# EAGLE design gLCD_i2c (EAGLE 4.16)
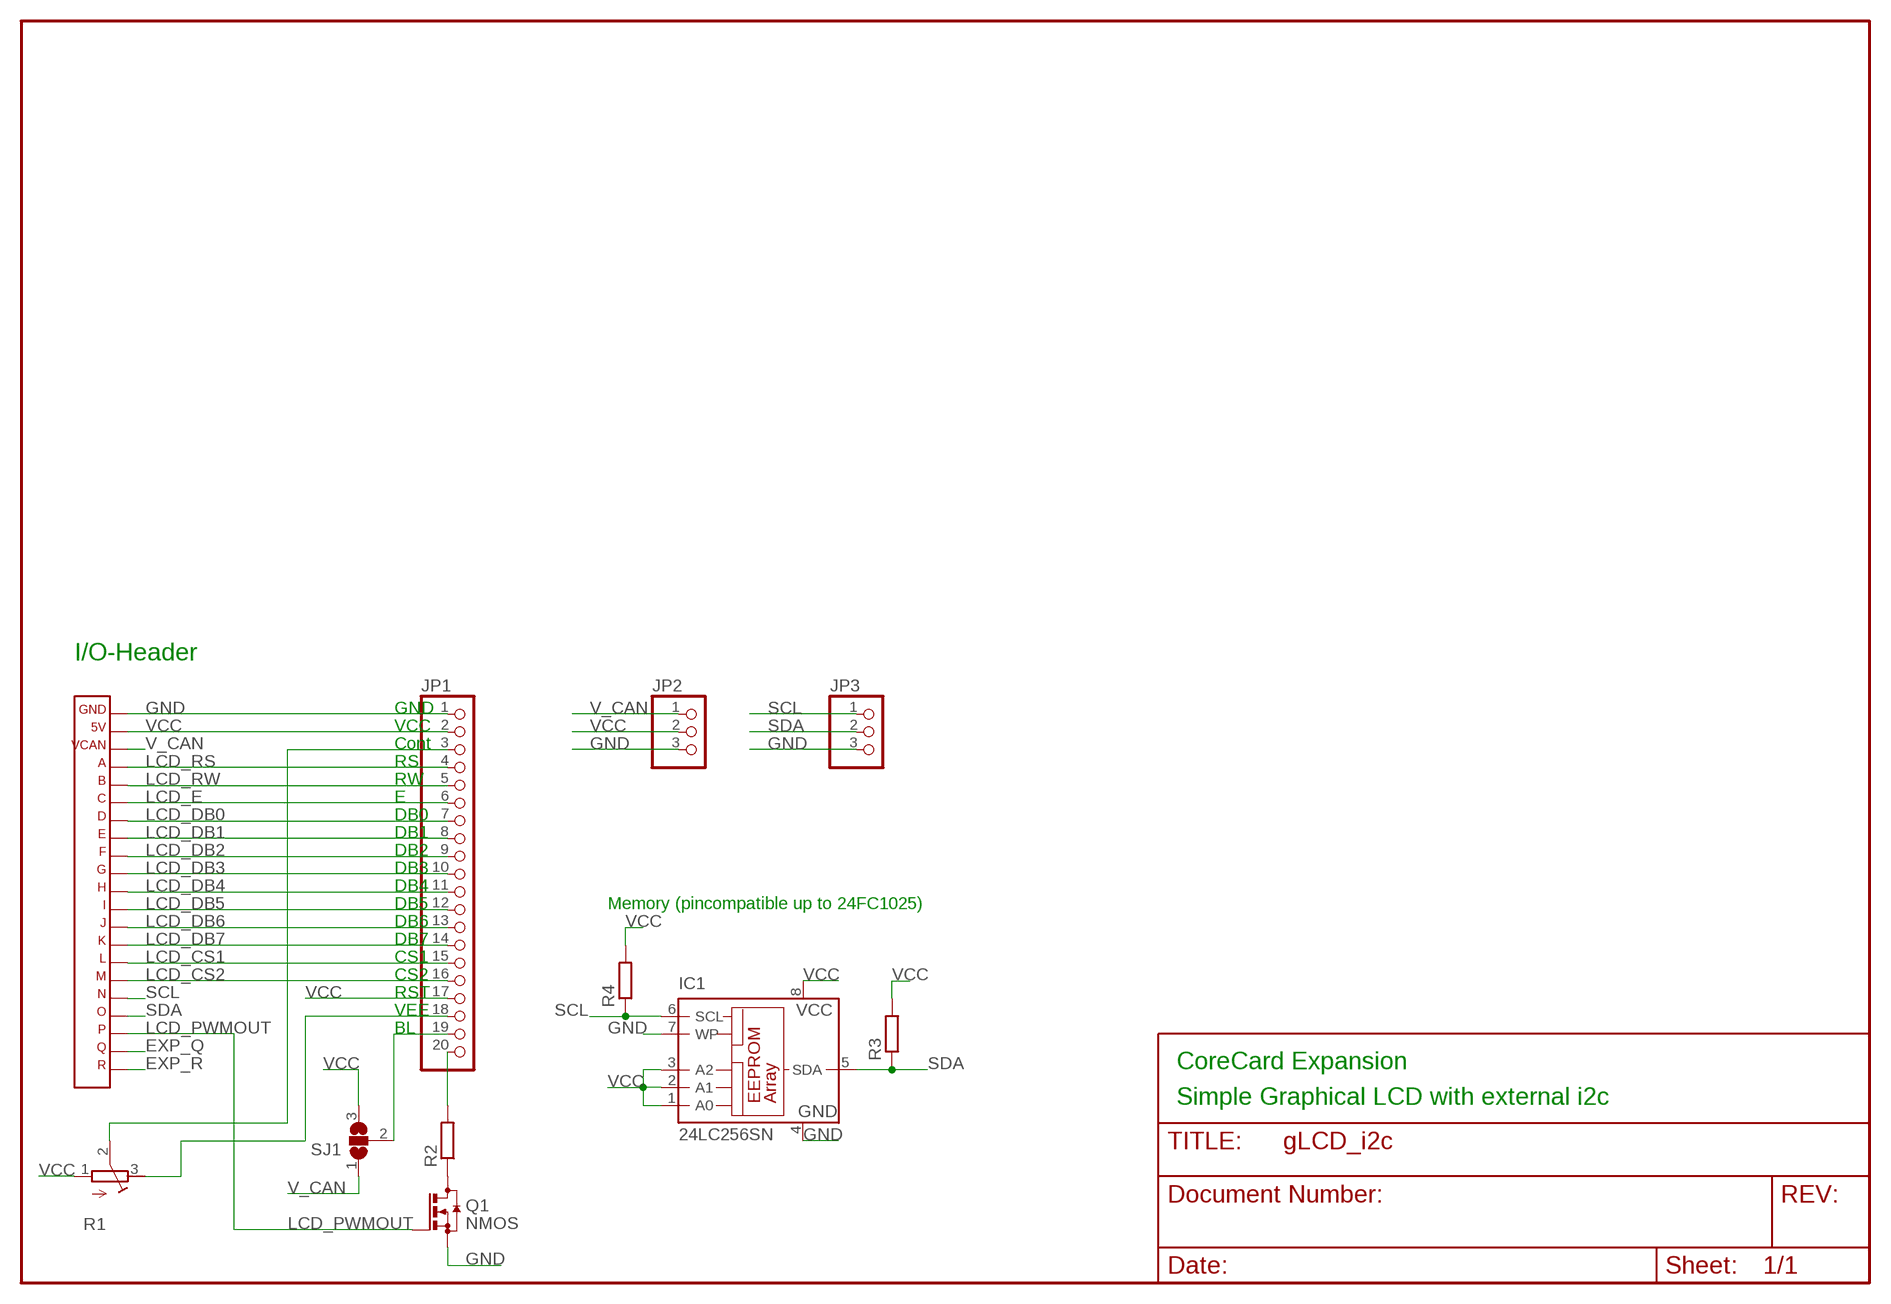
[diagram p0: schematic, sheet 1]

## Parts
IC1  24LC256SN  [SO-08]
JP1  PINHD-2X10  [2X10]
JP2  PINHD-1X3  [1X03]
JP3  PINHD-1X3  [1X03]
Q1  NMOS  [SOT23]
R1  R-TRIM  [TRIM_PVZ3]
R2  R-EU_0207/10  [0207/10]
R3  R-EUR0603  [R0603]
R4  R-EUR0603  [R0603]
SJ1  SJ_2_NOS  [SJ_2_NO_SMALL]
X3  CORE_IOHEADEXP  [CORE_IOHEAD_NOSILC]

## Nets
EXP_Q: X3.20
EXP_R: X3.21
GND: IC1.4(GND) IC1.7(WP) JP1.1 JP2.3 JP3.3 Q1.2(S) X3.1
LCD_CONTRAST: JP1.3 R1.2(PAD2)
LCD_CS1: JP1.15 X3.15
LCD_CS2: JP1.16 X3.16
LCD_DB0: JP1.7 X3.7
LCD_DB1: JP1.8 X3.8
LCD_DB2: JP1.9 X3.9
LCD_DB3: JP1.10 X3.10
LCD_DB4: JP1.11 X3.11
LCD_DB5: JP1.12 X3.12
LCD_DB6: JP1.13 X3.13
LCD_DB7: JP1.14 X3.14
LCD_E: JP1.6 X3.6
LCD_PWMOUT: Q1.1(G) X3.19
LCD_RS: JP1.4 X3.4
LCD_RW: JP1.5 X3.5
LCD_VEE: JP1.18 R1.3(PAD3)
N$1: Q1.3(D) R2.1
N$2: JP1.19 SJ1.2
N$4: JP1.20 R2.2
SCL: IC1.6(SCL) JP3.1 R4.1 X3.17
SDA: IC1.5(SDA) JP3.2 R3.1 X3.18
V_CAN: JP2.1 SJ1.1 X3.3
VCC: IC1.1(A0) IC1.2(A1) IC1.3(A2) IC1.8(VCC) JP1.2 JP1.17 JP2.2 R1.1(PAD1) R3.2 R4.2 SJ1.3 X3.2

## Notes on the sheet
- I/O-Header
- GND
- VCC
- Cont
- RS
- RW
- E
- DB0
- DB1
- DB2
- DB3
- DB4
- DB5 | Memory (pincompatible up to 24FC1025)
- DB6
- DB7
- CS1
- CS2
- RST
- VEE
- BL
- CoreCard Expansion
- Simple Graphical LCD with external i2c

## Library data of the parts
IC1 = microchip:24*: Serial EEPROM I2C
JP1 = pinhead-mm:PINHD-2X10
JP2 JP3 = pinhead:PINHD-1X3: PIN HEADER
Q1 = transistor:NMOS
R1 = rcl:R-TRIM
R2 = rcl:R-EU_: RESISTOR, European symbol
R3 R4 = rcl:R-EU
SJ1 = jumper:SJ_2_NO
X3 = expboard:CORE_IOHEAD: CoreCard IO-header for expansion cards

## Board
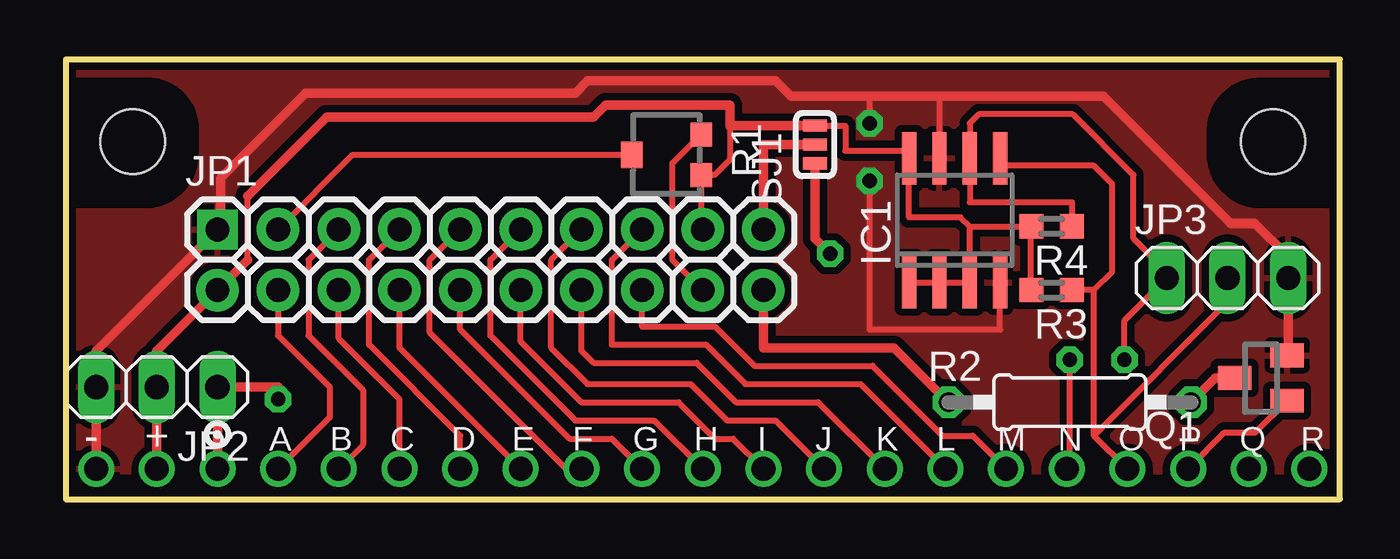
[diagram p1: board, top side]
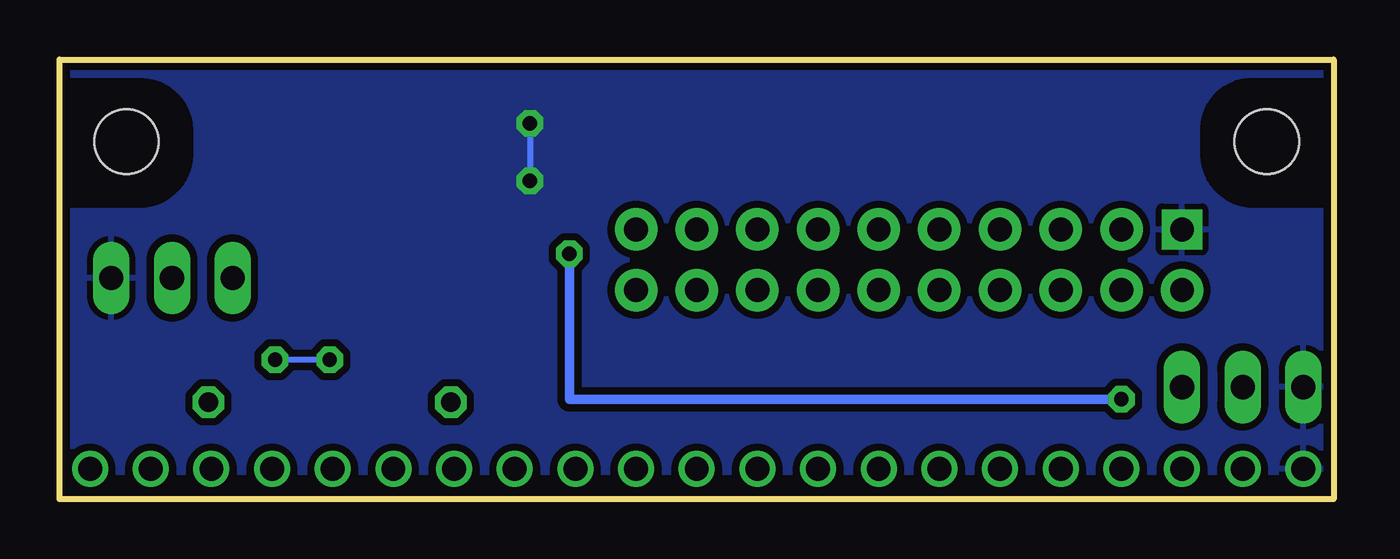
[diagram p2: board, bottom side, seen from below]

Size 53.34 x 18.41 mm. Coordinates in mm from the lower left corner, seen from the top.
Outline: 0,0 53.34,0 53.34,18.41 0,18.41 0,0
Copper layers (1*16): Top 0.035mm / dielectric 1.5mm / Bottom 0.035mm
Design rules "default": minimum track width 10mil, minimum drill 0.6mm, track to track 10mil, track to pad 10mil, pad to pad 10mil, via to via 10mil, smd to smd 8mil, copper to edge 10mil, drill to drill 8mil, minimum pad ring 10mil, minimum via ring 10mil, stop-mask expansion 4mil, vias tented up to drill 0mil, thermal gap 10mil
Holes 2.7 mm at 50.55,14.99 2.79,14.99

### Footprints (pad centres in the part's own frame; a part is rotated, then mirrored left to right if it is on the bottom)
SO-08 = smd 0.6 x 2.2: 1 -1.905,-2.6; 2 -0.635,-2.6; 3 0.635,-2.6; 4 1.905,-2.6; 5 1.905,2.6; 6 0.635,2.6; 7 -0.635,2.6; 8 -1.905,2.6
2X10 = drill 1 pad 1.676 square: 1 -10.16,1.27 | drill 1 pad 1.778 round: 2 -10.16,-1.27; 3 -7.62,1.27; 4 -7.62,-1.27; 5 -5.08,1.27; 6 -5.08,-1.27; 7 -2.54,1.27; 8 -2.54,-1.27; 9 0,1.27; 10 0,-1.27; 11 2.54,1.27; 12 2.54,-1.27; 13 5.08,1.27; 14 5.08,-1.27; 15 7.62,1.27; 16 7.62,-1.27; 17 10.16,1.27; 18 10.16,-1.27; 19 12.7,1.27; 20 12.7,-1.27
1X03 = drill 1.016 long: 1 -2.54,0; 2 0,0; 3 2.54,0
SOT23 = smd 1 x 1.4: 1 -0.95,-1.1; 2 0.95,-1.1; 3 0,1.1
TRIM_PVZ3 = smd 1 x 0.9: 1 0.5,0.45; 3 2.2,0.45 | smd 1.1 x 0.9: 2 1.35,3.35
0207/10 = drill 0.813 octagon: 1 -5.08,0; 2 5.08,0
R0603 = smd 0.991 x 1.016: 1 -0.85,0; 2 0.85,0
SJ_2_NO_SMALL = smd 0.508 x 1.016: 1 -0.787,0; 2 0,0; 3 0.787,0
CORE_IOHEAD_NOSILC = drill 1 round: 1 25.4,0; 2 22.86,0; 3 20.32,0; 4 17.78,0; 5 15.24,0; 6 12.7,0; 7 10.16,0; 8 7.62,0; 9 5.08,0; 10 2.54,0; 11 0,0; 12 -2.54,0; 13 -5.08,0; 14 -7.62,0; 15 -10.16,0; 16 -12.7,0; 17 -15.24,0; 18 -17.78,0; 19 -20.32,0; 20 -22.86,0; 21 -25.4,0

### Placement (x,y rotation side)
IC1  37.21,11.68 0 top
JP1  16.51,10.03 0 top
JP2  3.81,4.7 180 top
JP3  48.64,9.27 0 top
Q1  50.04,5.08 90 top
R1  27.05,13.08 90 top
R2  42.04,4.06 180 top
R3  41.27,8.76 180 top
R4  41.27,11.43 180 top
SJ1  31.37,14.86 90 top
X3  26.67,1.27 0 bottom

### Tracks (layer width: path | path; a pad name or v marks a point on that pad's centre or on a via)
GND  (via drill 0.6)
  Top 0.254: 36.58,14.22 IC1.7 36.58,16.89 | IC1.4 39.12,7.11 33.66,7.11 v33.66,13.34 | 33.66,16.89 v33.66,15.75 | 6.35,11.43 JP1.1 6.48,11.43 | 51.18,6.07 Q1.2
  Top 0.406: 6.48,11.43 6.48,13.46 10.03,17.02 21.34,17.02 21.84,17.53 29.72,17.53 30.35,16.89 33.66,16.89 36.58,16.89 43.43,16.89 48.77,11.56 49.78,11.56 51.18,10.16 JP3.3 51.18,6.07 | X3.1 JP2.3 1.27,6.22 JP1.1
  Bottom 0.254: v33.66,15.75 v33.66,13.34
  pour Bottom (isolate 0.305, rank 3): 0,18.41 53.34,18.41 53.34,17.78 50.04,17.78 arc90 47.62,15.49 47.62,14.48 arc90 50.04,12.06 53.34,12.06 53.34,1.14 0,1.14 0,12.06 3.3,12.06 arc90 5.71,14.48 5.71,15.49 arc90 3.43,17.78 0,17.78
  pour Top (isolate 0.305, rank 3): 0,18.41 53.34,18.41 53.34,17.78 50.04,17.78 arc90 47.62,15.49 47.62,14.48 arc90 50.04,12.06 53.34,12.06 53.34,1.14 0,1.14 0,12.06 3.3,12.06 arc90 5.71,14.48 5.71,15.49 arc90 3.43,17.78 0,17.78
LCD_CONTRAST
  Top 0.254: R1.2 12.02,14.43 JP1.3
LCD_CS1
  Top 0.254: X3.15 33.27,4.83 28.45,4.83 26.8,6.48 22.86,6.48 22.86,10.03 JP1.15
LCD_CS2
  Top 0.254: JP1.16 24.13,7.24 27.18,7.24 28.83,5.59 33.78,5.59 36.7,2.67 37.97,2.67 X3.16
LCD_DB0
  Top 0.254: JP1.7 12.7,10.03 12.7,6.48 16.51,2.67 X3.7
LCD_DB1
  Top 0.254: JP1.8 13.97,6.35 X3.8
LCD_DB2
  Top 0.254: X3.9 20.95,1.27 15.24,6.99 15.24,10.03 JP1.9
LCD_DB3
  Top 0.254: X3.10 22.86,2.54 21.08,2.54 16.51,7.11 JP1.10
LCD_DB4
  Top 0.254: X3.11 24.64,3.3 21.34,3.3 17.78,6.86 17.78,10.03 JP1.11
LCD_DB5
  Top 0.254: X3.12 27.94,2.54 27.18,2.54 25.65,4.06 21.59,4.06 19.05,6.6 JP1.12
LCD_DB6
  Top 0.254: JP1.13 20.32,10.03 20.32,6.35 21.84,4.83 26.16,4.83 27.69,3.3 29.72,3.3 X3.13
LCD_DB7
  Top 0.254: JP1.14 21.59,6.22 22.1,5.71 26.42,5.71 28.07,4.06 31.5,4.06 X3.14
LCD_E
  Top 0.254: 14.1,1.14 X3.6 13.97,4.19 11.43,6.73 JP1.6
LCD_PWMOUT
  Top 0.254: 46.99,1.14 X3.19 48.51,2.79 49.8,2.79 Q1.1
LCD_RS
  Top 0.254: 8.89,1.14 X3.4 11.05,3.43 11.05,4.7 8.89,6.86 JP1.4
LCD_RW
  Top 0.254: JP1.5 10.16,10.03 10.16,6.86 12.45,4.57 12.45,2.29 X3.5
LCD_VEE
  Top 0.254: JP1.18 25.4,10.03 25.4,14.08 R1.3
N$1
  Top 0.406: R2.1 48.13,5.08 Q1.3
N$2
  Top 0.406: SJ1.2 29.21,14.86 JP1.19
N$4
  Top 0.406: JP1.20 29.21,6.35 34.67,6.35 R2.2
SCL  (via drill 0.6)
  Top 0.254: R4.1 42.12,12.45 37.85,12.45 IC1.6 37.85,15.75 38.23,16.13 42.16,16.13 44.7,13.59 44.7,10.92 46.1,9.53 JP3.1 44.32,7.49 v44.32,5.84 | v42.04,5.84 42.04,1.4 X3.17
  Bottom 0.254: v42.04,5.84 v44.32,5.84
SDA
  Top 0.254: X3.18 43.05,2.67 | JP3.2 48.64,8.26 43.05,2.67 | 42.04,8.76 R3.1 43.05,8.76 | 43.05,2.67 43.05,8.76 | IC1.5 39.12,13.97 43.05,13.97 43.81,13.21 43.81,9.53 43.05,8.76
V_CAN  (via drill 0.6)
  Top 0.406: X3.3 JP2.1 8.89,4.7 v8.89,4.19 | SJ1.1 31.37,10.92 v32,10.29
  Bottom 0.406: v32,10.29 32,4.19 v8.89,4.19
VCC
  Top 0.254: IC1.1 IC1.2 IC1.3 37.85,11.43 | 37.85,11.43 40.39,11.43 | 40.39,11.43 R4.2 | R3.2 40.39,8.76 40.39,11.43 | JP1.17 26.6,11.37 R1.1 27.17,13.58 27.81,14.22 27.81,15.62 | 37.85,11.43 37.47,11.81 35.31,11.81 IC1.8 35.31,14.61 32.64,14.61 32.64,15.65 SJ1.3 | 7.62,10.03 7.62,12.7
  Top 0.406: IC1.2 36.58,9.14 | 35.31,9.14 IC1.1 35.31,8.89 | 7.62,10.03 JP1.2 3.81,6.22 JP2.2 X3.2 | 7.62,12.7 10.92,16 22.1,16 22.61,16.51 27.81,16.51 27.81,15.62 27.81,15.65 SJ1.3

### Text on the board
tPlace: - | + | A | B | C | D | E | F | G | H | I | J | K | L | M | N | O | P | Q | R
Document: Top is component side | Expansion will be mounted bottom to bottom with CoreCard | Change vertical dimension to fit | Remove I/O-header silcscreen if neccesary | Remove mounting holes if neccesary